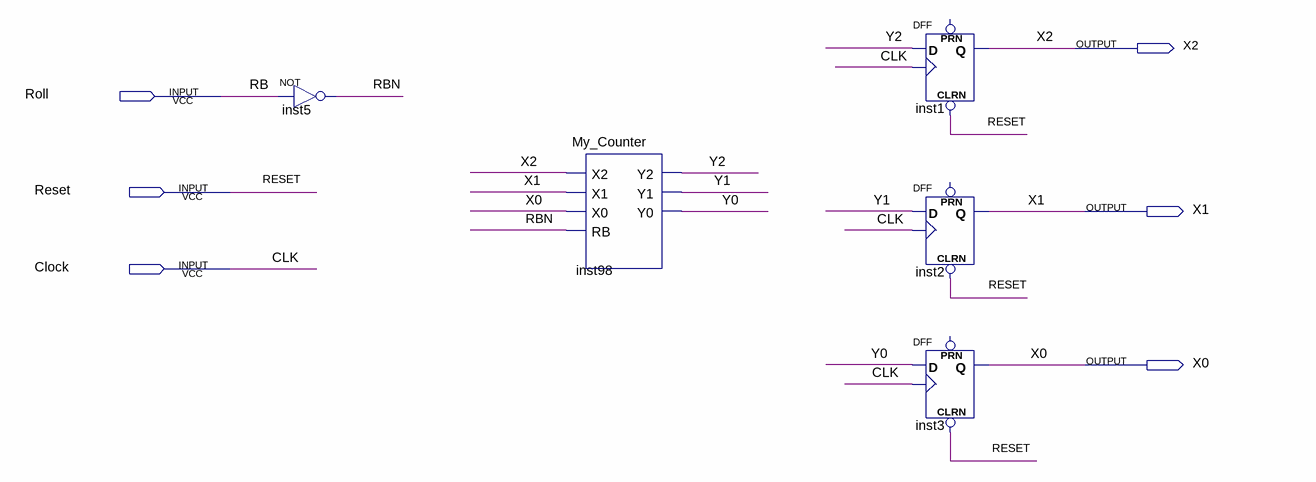
[diagram p0: schematic sheet]
// Quartus schematic lab5.bdf as structural Verilog: 5 symbols, 6 pins
module lab5 (
  input  Roll,
  input  Reset,
  input  Clock,
  output X2,
  output X1,
  output X0
);

  wire RBN, Y0, Y1, Y2;

  not inst5 (RBN, Roll);
  My_Counter inst98 (.X2(X2), .X1(X1), .X0(X0), .RB(RBN), .Y2(Y2), .Y1(Y1), .Y0(Y0));
  DFF inst1 (.CLRN(Reset), .CLK(Clock), .D(Y2), .Q(X2));  // open: PRN
  DFF inst2 (.CLRN(Reset), .CLK(Clock), .D(Y1), .Q(X1));  // open: PRN
  DFF inst3 (.CLRN(Reset), .CLK(Clock), .D(Y0), .Q(X0));  // open: PRN

  // Other names for the same wires on the sheet: CLK = Clock; RB = Roll
endmodule
